# EAGLE design EEZ PSU AUX PS r5B9 (EAGLE 6.1)
Assembly variants: Farnell, TME

## Sheet 1 of 2: AC soft-start, +5V power
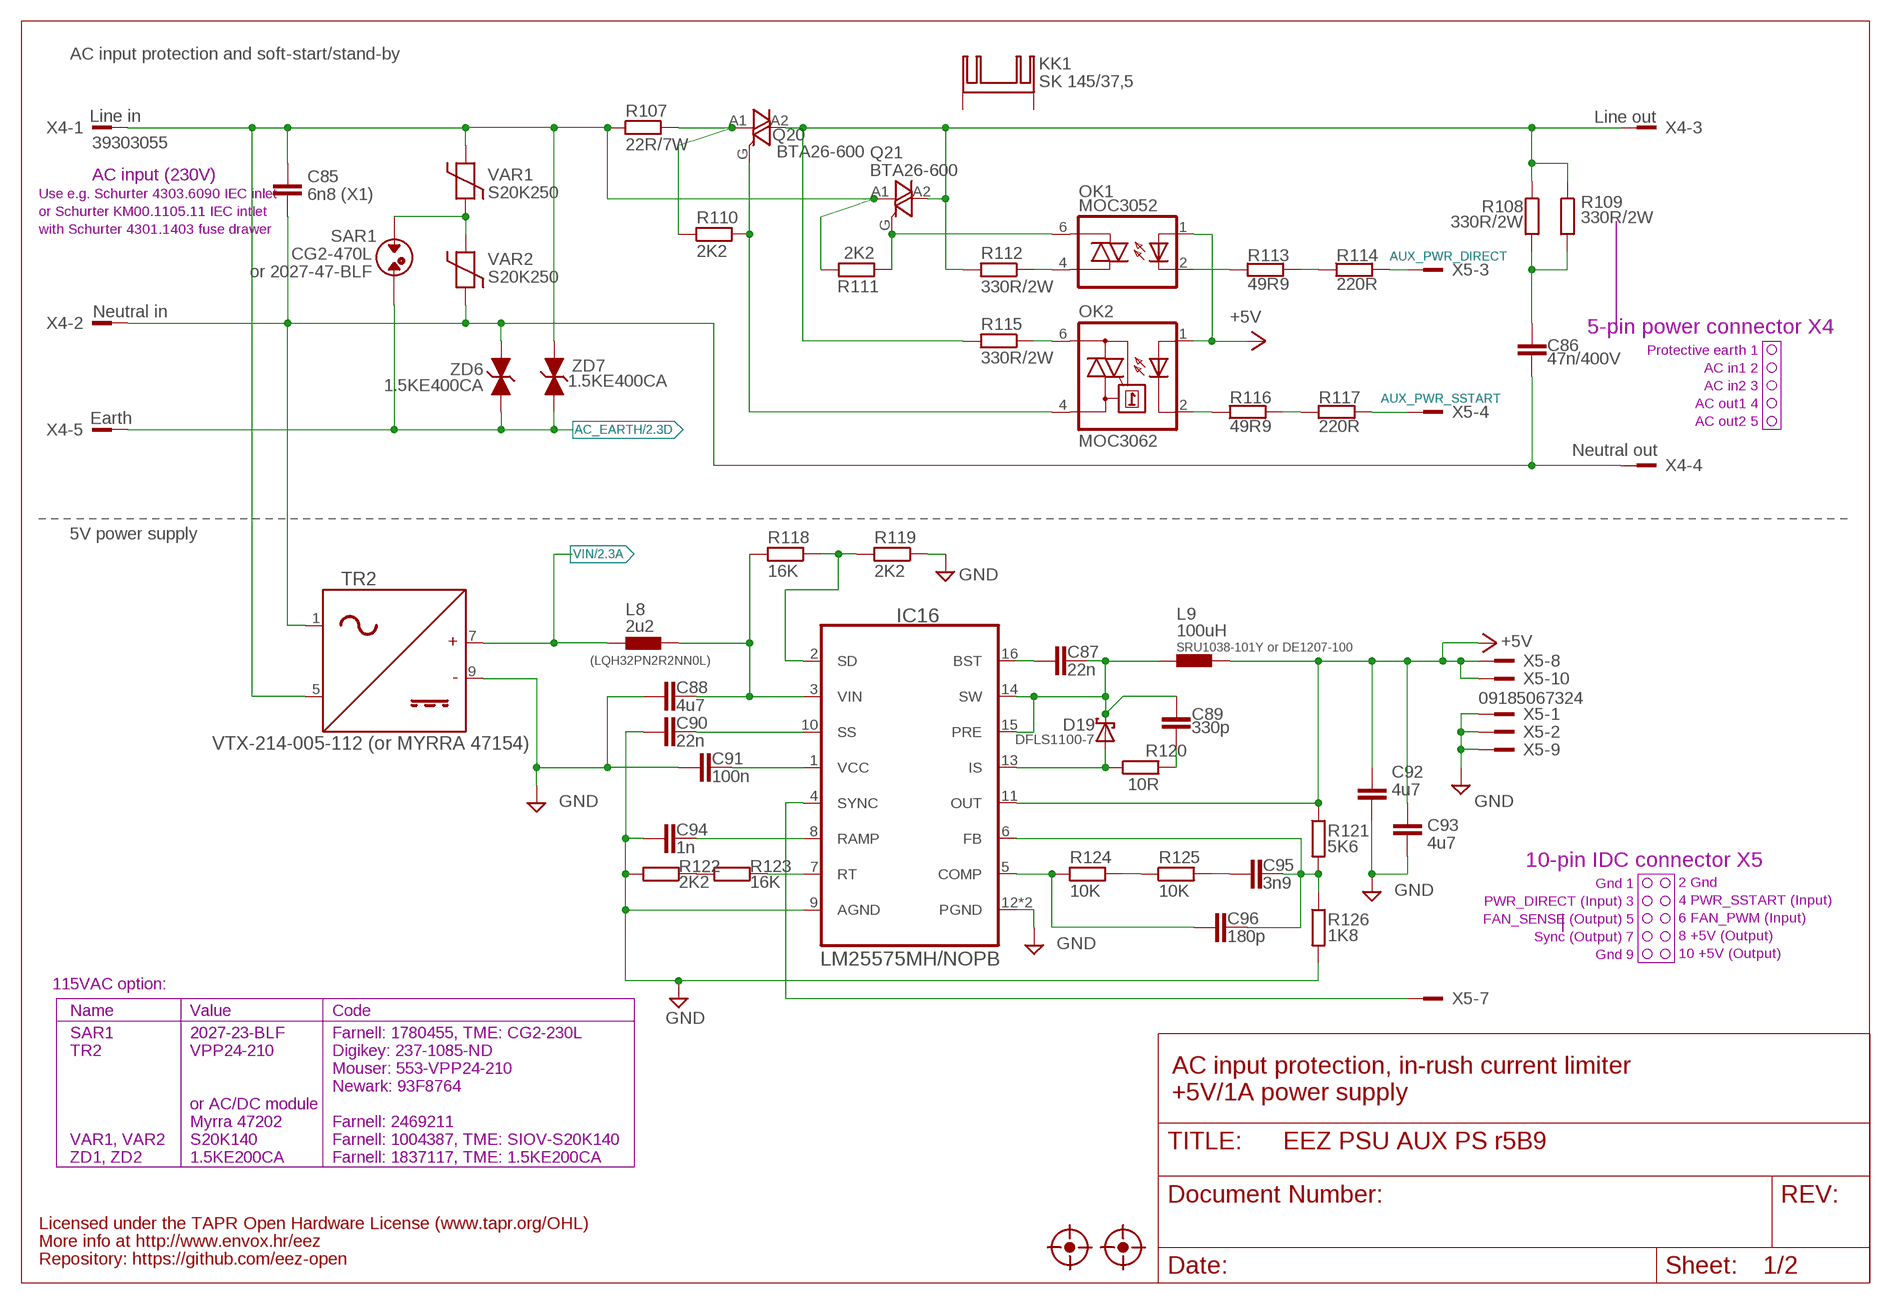
[diagram p0: schematic, sheet 1]

### Parts
C85  6n8 (X1)  C-EU102-064X133  [C102-064X133]
C86  47n/400V  C-EU075-052X106  [C075-052X106]
C87  22n  C-EUC0805  [C0805]
C88  4u7  C-EUC1210  [C1210]
C89  330p  C-EUC0805  [C0805]
C90  22n  C-EUC0805  [C0805]
C91  100n  C-EUC0603  [C0603]
C92  4u7  C-EUC1210  [C1210]
C93  4u7  C-EUC1210  [C1210]
C94  1n  C-EUC0805  [C0805]
C95  3n9  C-EUC0805  [C0805]
C96  180p  C-EUC0805  [C0805]
D19  DFLS1100-7  SCHOTTKYSOD123  [SOD123]
FM3  FIDUCIAL_2  [FIDUCIAL_DUAL]
FM4  FIDUCIAL_2  [FIDUCIAL_DUAL]
IC16  LM25575MH/NOPB  LM(2)5575  [SOP65P640X110-17N]
KK1  SK 145/37,5  SK145  [SK145]
L8  2u2  L1210  [L1210]
L9  100uH  COILCRAFT_MSS1278  [MSS1278]
OK1  MOC3052  MOC305X  [DIL6-SMD]
OK2  MOC3062  MOC3033S  [DIL6-SMD]
Q20  BTA26-600  BTA26-V  [TOP3S-1]
Q21  BTA26-600  BTA26-V  [TOP3S-1]
R107  22R/7W  R_EU7W  [R_0913]
R108  330R/2W  R-EU_R2512  [R2512]
R109  330R/2W  R-EU_R2512  [R2512]
R110  2K2  R-EU_R0805  [R0805]
R111  2K2  R-EU_R0805  [R0805]
R112  330R/2W  R-EU_R2512  [R2512]
R113  49R9  R-EU_R0805  [R0805]
R114  220R  R-EU_R0805  [R0805]
R115  330R/2W  R-EU_R2512  [R2512]
R116  49R9  R-EU_R0805  [R0805]
R117  220R  R-EU_R0805  [R0805]
R118  16K  R-EU_R0805  [R0805]
R119  2K2  R-EU_R0805  [R0805]
R120  10R  R-EU_R1206  [R1206]
R121  5K6  R-EU_R0805  [R0805]
R122  2K2  R-EU_R0805  [R0805]
R123  16K  R-EU_R0805  [R0805]
R124  10K  R-EU_R0805  [R0805]
R125  10K  R-EU_R0805  [R0805]
R126  1K8  R-EU_R0805  [R0805]
SAR1  CG2-470L  SAR  [SAR]
TR2  VTX-214-005-112 (or MYRRA 47154)  AC_DC_ADAPTER_5W  [PCB_ACDC_MYRRA_5W]
VAR1  S20K250  VARISTOR  [VARISTOR]
VAR2  S20K250  VARISTOR  [VARISTOR]
X4  39303055  MINIFIT_6659-5  [MINIFIT_6659-5]
X5  09185067324  IDC-10PINBLACK  [IDC-10PIN]
ZD6  1.5KE400CA  1.5KE-BIDIR  [DO201-BIDIR]
ZD7  1.5KE400CA  1.5KE-BIDIR  [DO201-BIDIR]

### Nets
+5V: C92.1 C93.1 IC16.11(OUT) L9.2 OK1.1(A) OK2.1(A) R121.1 X5.8 X5.10 ; also sheet 2
AC_EARTH: SAR1.P$2 X4.5 ZD6.C ZD7.C ; also sheet 2
AC_IN1_MAIN: C85.1 Q21.A1 R107.1 R111.2 TR2.5(IN2) VAR1.P$2 X4.1 ZD7.A
AC_IN2_MAIN: C85.2 C86.1 TR2.1(IN1) VAR2.P$1 X4.2 X4.4 ZD6.A
AUX_PWR_DIRECT: R114.2 X5.3
AUX_PWR_SSTART: R117.2 X5.4
DC_PREG2: C88.1 IC16.3(VIN) L8.2 R118.2
GND [gnd]: C88.2 C90.2 C91.1 C92.2 C93.2 C94.1 IC16.9(AGND) IC16.12(PGND) IC16.TP(PGND) R119.1 R122.2 R126.2 TR2.9(-) X5.1 X5.2 X5.9 ; also sheet 2
IS1: D19.A IC16.13(IS) R120.1
N$52: C95.2 R125.2
N$57: C95.1 C96.1 IC16.6(FB) R121.2 R126.1
N$58: C87.2 IC16.16(BST)
N$59: C96.2 IC16.5(COMP) R124.1
N$60: IC16.7(RT) R123.1
N$61: C91.2 IC16.1(VCC)
N$63: C94.2 IC16.8(RAMP)
N$66: C90.1 IC16.10(SS)
N$68: IC16.4(SYNC) X5.7
N$69: IC16.2(SD) R118.1 R119.2
N$70: C89.2 R120.2
N$71: OK1.6(A2) Q21.G R111.1
N$72: OK2.4(A1) Q20.G R110.2
N$73: OK2.6(A2) R115.1
N$74: R113.2 R114.1
N$75: R116.2 R117.1
N$76: OK1.4(A1) R112.1
N$81: Q20.A2 Q21.A2 R108.1 R109.1 R112.2 R115.2 X4.3
N$83: C86.2 R108.2 R109.2
N$114: SAR1.P$1 VAR1.P$1 VAR2.P$2
N$152: Q20.A1 R107.2 R110.1
N$169 [gnd]: R122.1 R123.2
N$171: R124.2 R125.1
N$174: OK2.2(C) R116.1
N$175: OK1.2(C) R113.1
SW2: C87.1 C89.1 D19.C IC16.14(SW) IC16.15(PRE) L9.1
VIN: L8.1 TR2.7(+) ; also sheet 2
Unconnected: KK1.1(K) KK1.2(K)

### Notes on the sheet
- AC input protection and soft-start/stand-by
- Line in
- Line out
- AC input (230V)
- Use e.g. Schurter 4303.6090 IEC inlet
- or Schurter KM00.1105.11 IEC intlet
- with Schurter 4301.1403 fuse drawer
- or 2027-47-BLF
- Neutral in
- 5-pin power connector X4
- Protective earth 1
- AC in1 2
- AC in2 3
- AC out1 4
- Earth
- AC out2 5
- Neutral out
- 5V power supply
- SRU1038-101Y or DE1207-100
- (LQH32PN2R2NN0L)
- 10-pin IDC connector X5
- Gnd 1
- 2 Gnd
- PWR_DIRECT (Input) 3
- 4 PWR_SSTART (Input)
- FAN_SENSE (Output) 5
- 6 FAN_PWM (Input)
- Sync (Output) 7
- 8 +5V (Output)
- Gnd 9
- 10 +5V (Output)
- 115VAC option:
- Name | Value | Code
- SAR1 | 2027-23-BLF | Farnell: 1780455, TME: CG2-230L
- TR2 | VPP24-210 | Digikey: 237-1085-ND
- Mouser: 553-VPP24-210 | AC input protection, in-rush current limiter
- Newark: 93F8764
- +5V/1A power supply
- or AC/DC module
- Myrra 47202 | Farnell: 2469211
- VAR1, VAR2 | S20K140 | Farnell: 1004387, TME: SIOV-S20K140
- ZD1, ZD2 | 1.5KE200CA | Farnell: 1837117, TME: 1.5KE200CA
- Licensed under the TAPR Open Hardware License (www.tapr.org/OHL)
- More info at http://www.envox.hr/eez
- Repository: https://github.com/eez-open

## Sheet 2 of 2: Ethernet, USB, Fan
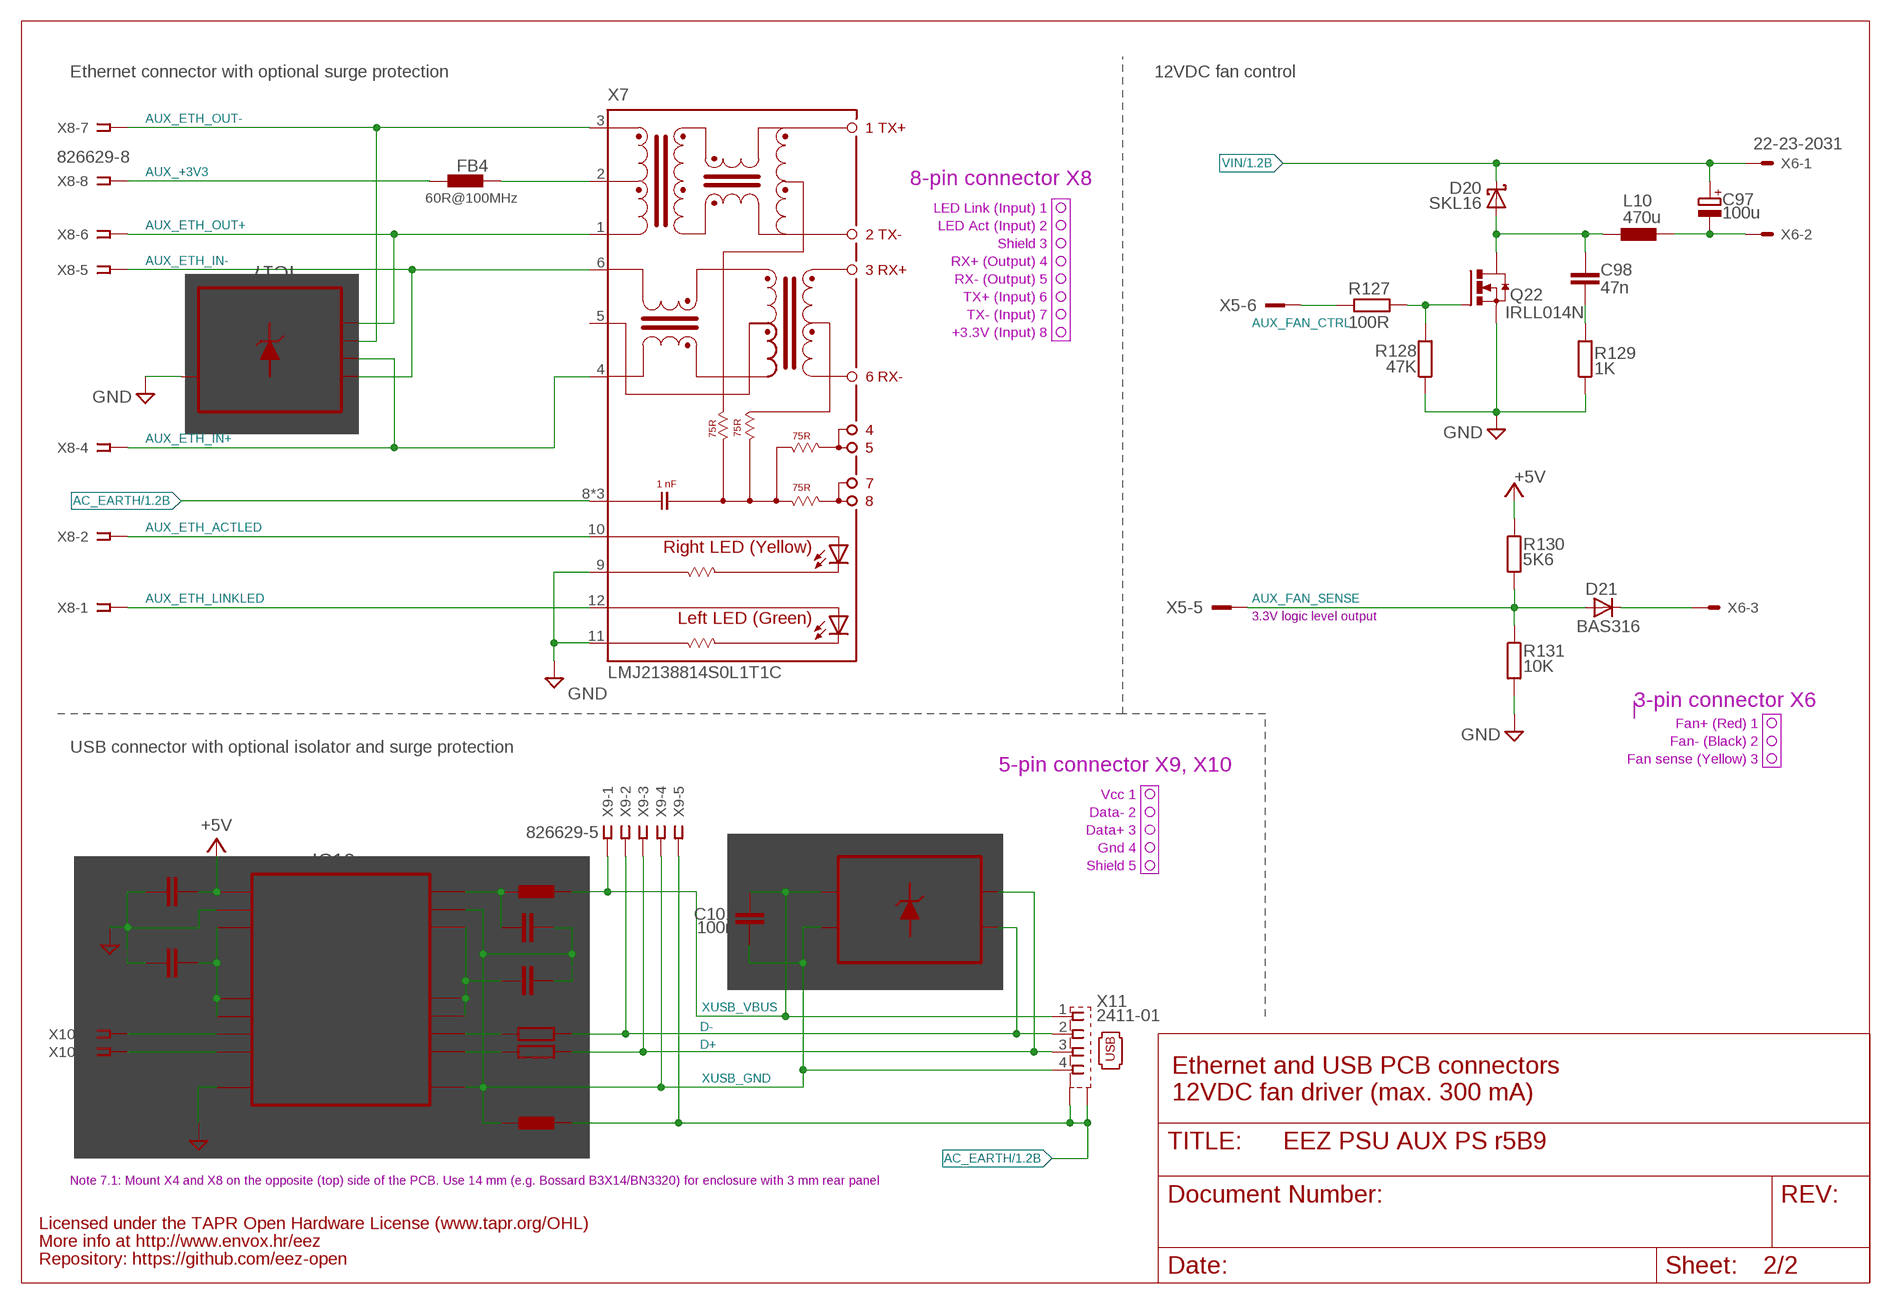
[diagram p1: schematic, sheet 2]

### Parts
C97  100u  ECAPPANASONIC_H  [CAPAE660X610N]
C98  47n  C-EUC0805  [C0805]
C99  100n  C-EUC0603  [C0603]
C100  100n  C-EUC0603  [C0603]
C101  100n  C-EUC0603  [C0603]
C102  100n  C-EUC0603  [C0603]
C103  100n  C-EUC0603  [C0603]
D20  SKL16  SCHOTTKYSOD123  [SOD123]
D21  BAS316  DIODE-SOD323-W  [SOD323-W]
FB4  60R@100MHz  FERRITE_BEAD0603  [BEAD0603]
FB5  60R@100MHz  FERRITE_BEAD0603  [BEAD0603]
FB6  60R@100MHz  FERRITE_BEAD0603  [BEAD0603]
IC17  TPD4E002DRLR  [SOT50P280X60-5N]
IC18  TPD2E001DZDR  [SOP192P292X122-4N]
IC19  ADUM3160BRWZ  ADUM3160BRWZWIDE  [SOIC-16W]
L10  470u  DE0704  [DE0704]
Q22  IRLL014N  N-HEXFET-2D_SOT232-IRLL014N  [SOT223]
R127  100R  R-EU_R0805  [R0805]
R128  47K  R-EU_R0805  [R0805]
R129  1K  R-EU_R0805  [R0805]
R130  5K6  R-EU_R0805  [R0805]
R131  10K  R-EU_R0805  [R0805]
R132  22R  R-EU_R0805  [R0805]
R133  22R  R-EU_R0805  [R0805]
X6  22-23-2031  [22-23-2031]
X7  LMJ2138814S0L1T1C  RJ45-VERTLMJ2138814S0L1T1C  [RJ45-VERT]
X8  826629-8  SSW-108-02-S-S  [SSW-108-02-S-S]
X9  826629-5  SSW-105-02-S-S  [SSW-105-02-S-S]
X10  826629-5  SSW-105-02-S-S  [SSW-105-02-S-S]
X11  2411-01  KUSBVX-BS1N  [KUSBVX-BS1N]

### Nets
+5V: C99.1 IC19.16(VBUS2) R130.1 ; also sheet 1
AC_EARTH: FB6.P$1 X7.8(SH) X7.SH1(SH) X7.SH2(SH) X9.5 X11.M1(S1) X11.M2(S2) ; also sheet 1
AUX_+3V3: FB4.P$2 X8.8
AUX_ETH_ACTLED: X7.10(YELLOW_A) X8.2
AUX_ETH_IN+: IC17.4(IO3) X7.4(RD-) X8.4
AUX_ETH_IN-: IC17.5(IO4) X7.6(RD+) X8.5
AUX_ETH_LINKLED: X7.12(GREEN-A) X8.1
AUX_ETH_OUT+: IC17.1(IO1) X7.1(TD-) X8.6
AUX_ETH_OUT-: IC17.3(IO2) X7.3(TD+) X8.7
AUX_FAN_CTRL: R127.2 X5.6
AUX_FAN_SENSE: D21.A R130.2 R131.1 X5.5
D+: IC18.2(IO1) R133.1 X9.3 X11.3
D-: IC18.3(IO2) R132.1 X9.2 X11.2
FAN_OUT: C98.2 D20.A L10.2 Q22.2(D) Q22.4(D)
GND [gnd]: C99.2 C102.2 IC17.2(GND) IC19.9(GND2) IC19.15(GND2_2) Q22.3(S) R128.1 R129.1 R131.2 X7.9(YELLOW-C) X7.11(GREEN-C) ; supply symbol labelled PGND ; also sheet 1
MCU_D+: IC19.10(DD+) X10.3
MCU_D-: IC19.11(DD-) X10.2
N$84: C98.1 R129.2
N$85: Q22.1(G) R127.1 R128.2
N$86: C97.2(-) L10.1 X6.2
N$87: C103.1 IC19.3(VDD1) IC19.4(PDEN) IC19.5(SPU)
N$88: IC19.6(UD-) R132.2
N$89: IC19.7(UD+) R133.2
N$90: C100.1 FB5.P$2 IC19.1(VBUS1)
N$91: C102.1 IC19.12(PIN) IC19.13(SPD) IC19.14(VDD2)
N$125: FB4.P$1 X7.2(CT)
N$163: D21.C X6.3
VIN: C97.1(+) D20.C X6.1 ; also sheet 1
XUSB_GND: C100.2 C101.1 C103.2 FB6.P$2 IC18.1(GND) IC19.2(GND1_2) IC19.8(GND1) X9.4 X11.4
XUSB_VBUS: C101.2 FB5.P$1 IC18.4(VCC) X9.1 X11.1
Unconnected: X7.5(CR) X8.3 X10.1 X10.4 X10.5

### Notes on the sheet
- Ethernet connector with optional surge protection | 12VDC fan control
- 8-pin connector X8
- LED Link (Input) 1
- LED Act (Input) 2
- Shield 3
- RX+ (Output) 4
- RX- (Output) 5
- TX+ (Input) 6
- TX- (Input) 7
- +3.3V (Input) 8
- 3.3V logic level output
- 3-pin connector X6
- Fan+ (Red) 1
- Fan- (Black) 2
- USB connector with optional isolator and surge protection
- Fan sense (Yellow) 3
- 5-pin connector X9, X10
- Vcc 1
- Data- 2
- Data+ 3
- Gnd 4
- Shield 5
- Ethernet and USB PCB connectors
- 12VDC fan driver (max. 300 mA)
- Note 7.1: Mount X4 and X8 on the opposite (top) side of the PCB. Use 14 mm (e.g. Bossard B3X14/BN3320) for enclosure with 3 mm rear panel
- Licensed under the TAPR Open Hardware License (www.tapr.org/OHL)
- More info at http://www.envox.hr/eez
- Repository: https://github.com/eez-open

## Library data of the parts
C85-C96 C98-C103 = rcl:C-EU: CAPACITOR, European symbol
C97 = EEZ_Lib1:ECAP
D19 D20 = EEZ_Lib1:SCHOTTKY
D21 = diode:DIODE-: DIODE
FB4-FB6 = MyLib6:FERRITE_BEAD: FAIR-RITE - 2506033007Y3 - FERRITE BEAD, 0.04OHM, 3A, 0603 Farnell: 2112873
FM3 FM4 = EEZ_Lib1:FIDUCIAL: Fiducial mark for pick and place automation
IC16 = EEZ_Lib1:LM(2)5575: Simple Switcher® 42V, 1.5A Step-Down Switching Regulator
IC17 = EEZ_Lib1:TPD4E002: Low-Capacitance 4-Channel +/-15-kV ESD Protection Array for High-Speed Data Interfaces
IC18 = EEZ_Lib1:TPD2E001: Low-Capacitance 2-Channel +/-15 kV ESD-Protection Array for High-Speed Data Interfaces
IC19 = MyLib6:ADUM3160BRWZ: Full/Low Speed 2.5 kV USB Digital Isolator
KK1 = EEZ_Lib1:SK145: FISCHER ELEKTRONIK SK 145/37,5 STS-220 Heat Sink, TO-220, TO-218, TO-220, TO-247, TO-248, 12 °C/W, 29 mm, 12 mm
L8 = EEZ_Lib1:L1210
L9 = EEZ_Lib1:COILCRAFT_MSS1278: Coilcraft SMT Power Inductors – MSS1278
L10 = EEZ_Lib1:DE0704: Ferrocore SMD power coil 7.3 x 7.3 mm
OK1 = EEZ_Lib1:MOC305X: 6-pin DIP Random-phase Optoisolators Triac Drivers (600V Peak)
OK2 = optocoupler:MOC30*: 6-Pin DIP Zero-Cross Optoisolators Triac Driver Output (250/400 Volt Peak) Source: http://www.fairchildsemi.com/ds/MO/MOC3043-M.pdf; MF: FAIRCHILD SEMICONDUCTOR; MPN: MOC3033S-M; OC_FARNELL: unknown; OC_NEWARK: 05C2878
Q20 Q21 = triac:BTA26: 25A TRIAC Source: http://www.st.com/stonline/products/literature/ds/7470.pdf
Q22 = transistor-power:N-HEXFET-2D_?-*: HEXFET® Power MOSFET 2 Drain connects http://www.irf.com/product-info/datasheets/data/irll014n.pdf
R107 = EEZ_Lib1:R_EU: RESISTOR - European symbol
R108-R133 = rcl:R-EU_: RESISTOR, European symbol
SAR1 = EEZ_Lib1:SAR: EPCOS surge arrester EF470X Farnell: 1886596
TR2 = EEZ_Lib1:AC_DC_ADAPTER: MYRRA 47202 AC/DC PCB Mount Power Supply, Switch Mode, Fixed, 1 Output
VAR1 VAR2 = EEZ_Lib1:VARISTOR: EPCOS - B72220S0251K101 - VARISTOR, 140J, 250VAC Farnell: 1004357
X4 = EEZ_Lib1:MINIFIT_6659-5: MOLEX 39303035 Wire-To-Board Connector, Single In Line, Mini-Fit Jr 5569 Series, 5 Contacts, Plug, 4.2 mm
X5 = EEZ_Lib1:IDC-10PIN: 10-pin IDC socket male, straight; TME: T821-1-10-S1
X6 = con-molex:22-23-2031: .100" (2.54mm) Center Header - 3 Pin; MF: MOLEX; MPN: 22-23-2031; OC_FARNELL: 1462950; OC_NEWARK: 30C0862
X7 = EEZ_Lib1:RJ45-VERT: AMPHENOL LMJ2138812S0LOT6C Socket; RJ45; PIN:8; vertical, shielded, with LED and trafo
X8 = con-samtec:SSW-108-02-S-S: THROUGH-HOLE .025" SQ POST SOCKET Source: Samtec SSW.pdf; MPN: SSW-108-02-S-S; OC_FARNELL: unknown; OC_NEWARK: 11P9448
X9 X10 = con-samtec:SSW-105-02-S-S: THROUGH-HOLE .025" SQ POST SOCKET Source: Samtec SSW.pdf; MPN: SSW-105-02-S-S; OC_FARNELL: unknown; OC_NEWARK: 11P9399
X11 = con-kycon:KUSBVX-BS1N: USB B-type Receptacle Vertical, 4 Position, Through Hole Source: Sibalco Kycon KUSBVX-BS1N-xxx.pdf
ZD6 ZD7 = EEZ_Lib1:1.5KE-BIDIR

## Net classes
0 default: width 0.254 mm, drill 0.584 mm, clearance 0.254 mm
1 dgnd: width 0.254 mm, drill 0.584 mm, clearance 0.254 mm
2 gnd: width 0.254 mm, drill 0.584 mm, clearance 0.254 mm

## Board
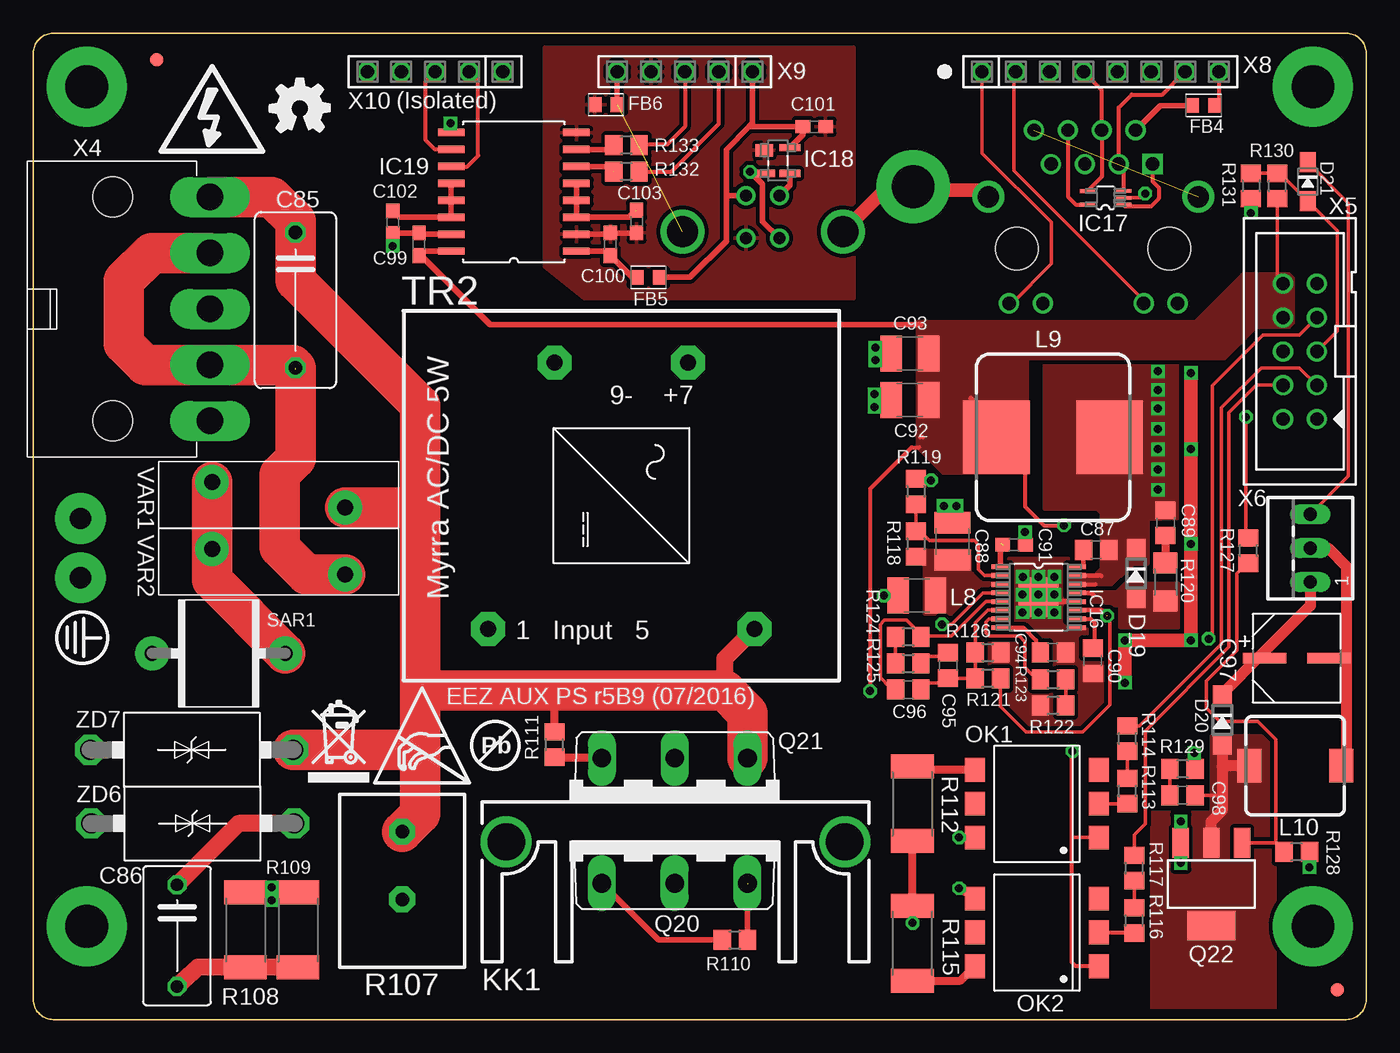
[diagram p2: board, top side]
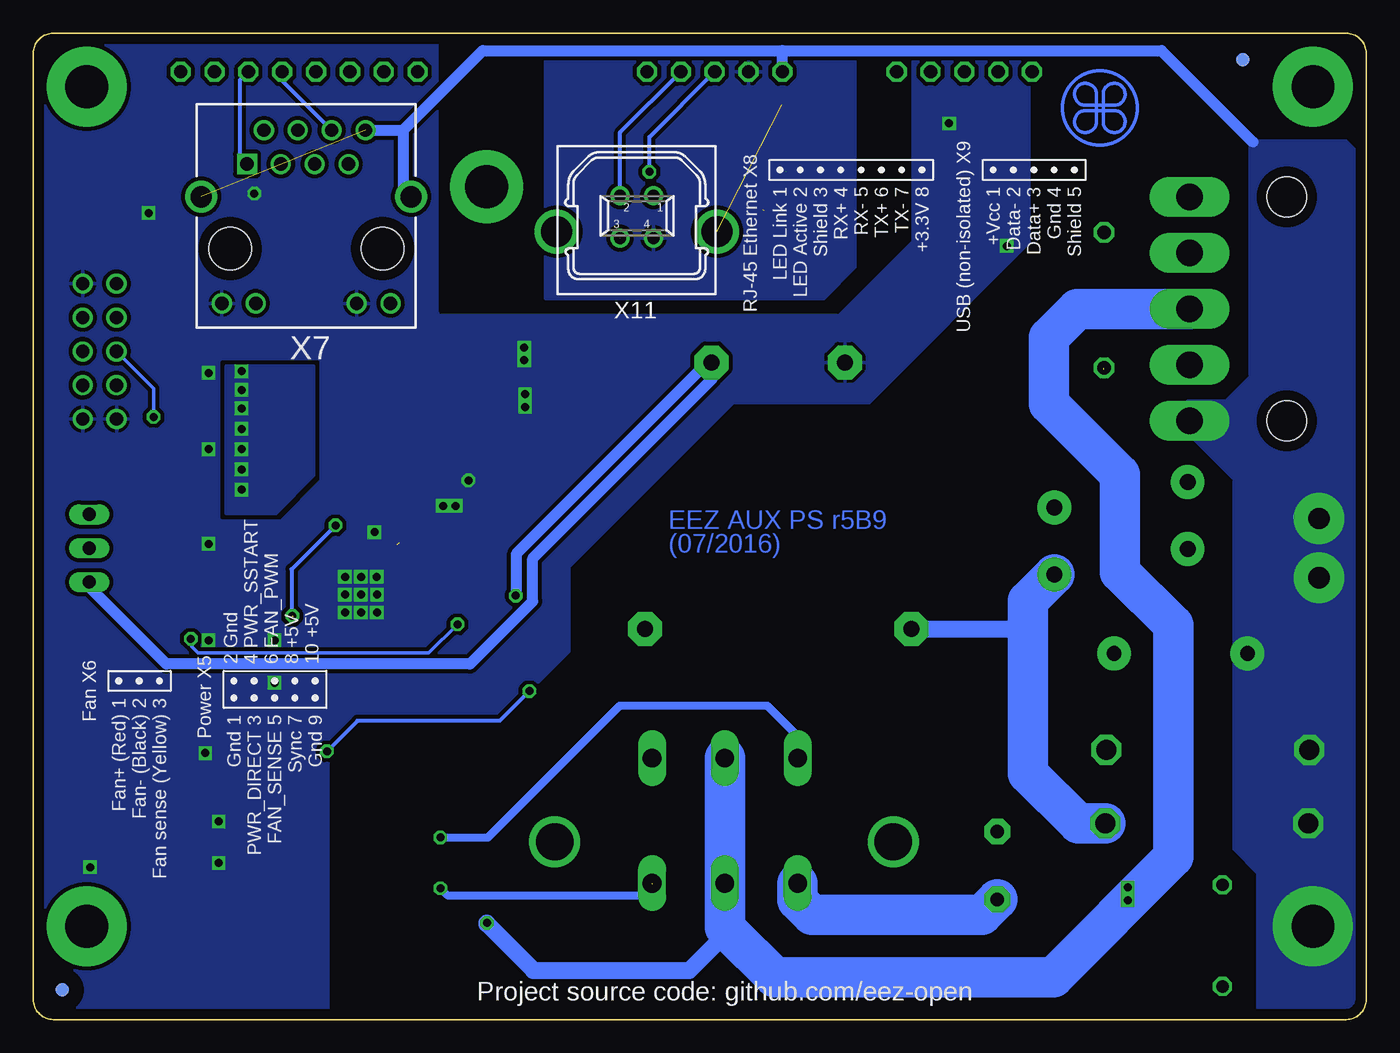
[diagram p3: board, bottom side, seen from below]

Size 100 x 74 mm. Coordinates in mm from the lower left corner, seen from the top.
Outline: 1.5,74 98.5,74 arc-90 100,72.5 100,1.5 arc-90 98.5,0 1.5,0 arc-90 0,1.5 0,72.5 arc-90 1.5,74
Copper layers (1+5*16): Top 0.035mm / dielectric 0.75mm / Route5 0.035mm / dielectric 0.75mm / Bottom 0.035mm
Design rules: minimum track width 10mil, minimum drill 0.5mm, track to track 8mil, track to pad 8mil, pad to pad 8mil, via to via 8mil, smd to smd 8mil, copper to edge 30mil, drill to drill 8mil, minimum pad ring 10mil, minimum via ring 8mil, stop-mask expansion 4mil, vias tented up to drill 25mil, thermal gap 10mil

### Footprints (pad centres in the part's own frame; a part is rotated, then mirrored left to right if it is on the bottom)
C102-064X133 = drill 1.016 octagon: 1 -5.08,0; 2 5.08,0
C075-052X106 = drill 0.914 octagon: 1 -3.81,0; 2 3.81,0
C0805 = smd 1.3 x 1.5: 1 -0.95,0; 2 0.95,0
C1210 = smd 1.6 x 2.7: 1 -1.4,0; 2 1.4,0
C0603 = smd 1.1 x 1: 1 -0.85,0; 2 0.85,0
CAPAE660X610N = smd 3.251 x 0.762: 1 -2.413,0; 2 2.413,0
SOD123 = smd 1.4 x 1.4: A 1.9,0; C -1.9,0
SOD323-W = smd 1.5 x 1.2: A 1.45,0; C -1.45,0
BEAD0603 = smd 1 x 1.1: P$1 -0.85,0; P$2 0.85,0
FIDUCIAL_DUAL = smd 1.016 x 1.016 bottom: B 0,0 | smd 1.016 x 1.016: T 0,0
SOP65P640X110-17N = smd 1.422 x 0.356: 1 -2.845,2.286; 2 -2.845,1.626; 3 -2.845,0.965; 4 -2.845,0.33; 5 -2.845,-0.33; 6 -2.845,-0.965; 7 -2.845,-1.626; 8 -2.845,-2.286; 9 2.845,-2.286; 10 2.845,-1.626; 11 2.845,-0.965; 12 2.845,-0.33; 13 2.845,0.33; 14 2.845,0.965; 15 2.845,1.626; 16 2.845,2.286 | smd 2.997 x 2.997: TP 0,0
SOT50P280X60-5N = smd 1.118 x 0.254: 1 -1.372,0.508; 2 -1.372,0; 3 -1.372,-0.508 | smd 1.118 x 0.305: 4 1.372,-0.508; 5 1.372,0.508
SOP192P292X122-4N = smd 0.94 x 1.321: 1 -0.762,-1.016 | smd 0.559 x 1.575: 2 0.965,-1.016; 3 0.965,0.889; 4 -0.965,0.889
SOIC-16W = smd 1.981 x 0.559: 1 -4.699,4.445; 2 -4.699,3.175; 3 -4.699,1.905; 4 -4.699,0.635; 5 -4.699,-0.635; 6 -4.699,-1.905; 7 -4.699,-3.175; 8 -4.699,-4.445; 9 4.699,-4.445; 10 4.699,-3.175; 11 4.699,-1.905; 12 4.699,-0.635; 13 4.699,0.635; 14 4.699,1.905; 15 4.699,3.175; 16 4.699,4.445
SK145 = drill 2.8: 1 -12.7,0; 2 12.7,0
L1210 = smd 1.6 x 2.7: 1 -1.4,0; 2 1.4,0
MSS1278 = smd 5.5 x 5: 1 0,4.25; 2 0,-4.25
DE0704 = smd 2.5 x 1.8: 1 0,3.45; 2 0,-3.45
DIL6-SMD = smd 1.78 x 1.52: 1 -2.54,-4.645; 2 0,-4.645; 3 2.54,-4.645; 4 2.54,4.645; 5 0,4.645; 6 -2.54,4.645
TOP3S-1 = drill 1.397 long: A1 -5.461,-3.175; A2 0,-3.175; G 5.461,-3.175
SOT223 = smd 1.219 x 2.235: 1 -2.311,-3.099; 2 0,-3.099; 3 2.311,-3.099 | smd 3.6 x 2.2: 4 0,3.099
R_0913 = drill 1.016 pad 1.93 octagon: 1 -3.556,0; 2 1.524,0
R2512 = smd 1.8 x 3.2: 1 -2.8,0; 2 2.8,0
R0805 = smd 1.3 x 1.5: 1 -0.95,0; 2 0.95,0
R1206 = smd 1.6 x 1.803: 1 -1.422,0; 2 1.422,0
SAR = drill 1.1 pad 2.54: P$1 0,0; P$2 10,0
PCB_ACDC_MYRRA_5W = drill 1.2 pad 2.54 octagon: 1 10,-10; 5 10,10; 7 -10,5; 9 -10,-5
VARISTOR = drill 1.2 pad 2.54: P$1 -5,0.95; P$2 5,-0.95
MINIFIT_6659-5 = drill 2 pad 2.54 long: 1 0,0; 2 0,-4.2; 3 0,-8.4; 4 0,-12.6; 5 0,-16.8 | hole 3: -7.3,0; -7.3,-16.8
IDC-10PIN = drill 1 pad 1.422: 1 -5.08,-1.27; 2 -5.08,1.27; 3 -2.54,-1.27; 4 -2.54,1.27; 5 0,-1.27; 6 0,1.27; 7 2.54,-1.27; 8 2.54,1.27; 9 5.08,-1.27; 10 5.08,1.27
22-23-2031 = drill 1 long: 1 -2.54,0; 2 0,0; 3 2.54,0
RJ45-VERT = drill 1 square: 1 4.445,-5.08 | drill 1: 2 3.175,-7.62; 3 1.905,-5.08; 4 0.635,-7.62; 5 -0.635,-5.08; 6 -1.905,-7.62; 7 -3.175,-5.08; 8 -4.445,-7.62; 9 6.325,5.38; 10 3.785,5.38; 11 -3.785,5.38; 12 -6.325,5.38 | drill 1.6: SH1 7.875,-2.62; SH2 -7.875,-2.62 | hole 3.2: -5.715,1.27; 5.715,1.27
SSW-108-02-S-S = drill 1 pad 1.5 octagon: 1 -8.89,0; 2 -6.35,0; 3 -3.81,0; 4 -1.27,0; 5 1.27,0; 6 3.81,0; 7 6.35,0; 8 8.89,0
SSW-105-02-S-S = drill 1 pad 1.5 octagon: 1 -5.08,0; 2 -2.54,0; 3 0,0; 4 2.54,0; 5 5.08,0
KUSBVX-BS1N = drill 0.9 pad 1.422: 1 1.25,2.7; 2 -1.25,2.7; 3 -1.25,-0.5; 4 1.25,-0.5 | drill 2.3 pad 2.7: M1 -6.02,0; M2 6.02,0
DO201-BIDIR = drill 1.499 octagon: A 7.62,0; C -7.62,0

### Placement (x,y rotation side)
C85  19.67,53.98 270 top
C86  10.78,6.29 270 top
C87  79.74,35.24 180 top
C88  68.95,35.88 90 top
C89  84.95,37.27 270 top
C90  79.49,26.92 270 top
C91  73.58,35.62 180 top
C92  65.77,46.48 180 top
C93  65.77,49.97 180 top
C94  76.5,27.56 180 top
C95  68.63,26.57 90 top
C96  65.64,24.77 180 top
C97  94.79,27.11 0 top
C98  86.22,16.83 0 top
C99  28.94,58.17 90 top
C100  43.29,58.17 90 top
C101  58.6,66.99 180 top
C102  26.97,59.82 270 top
C103  45.26,59.88 270 top
D19  82.73,33.46 270 top
D20  89.2,22.48 270 top
D21  95.62,62.87 270 top
EEZ_SIGNATURE1  SIGNATURESMALL  [SIGNATURE_5MM]  19.98,68.4 180 top
FB4  87.81,68.58 0 top
FB5  46.15,55.69 180 top
FB6  42.97,68.64 180 top
FM3  9.26,72.01 0 top
FM4  97.84,2.22 0 top
IC16  75.42,31.69 0 top
IC17  80.44,61.66 180 top
IC18  55.87,64.45 270 top
IC19  36.05,62.1 180 top
KK1  48.18,13.34 180 top
L8  66.28,31.81 0 top
L9  76.5,43.69 270 top
L10  94.66,19.05 270 top
OK1  75.3,16.19 90 top
OK2  75.3,6.54 90 top
Q20  48.12,13.4 0 top
Q21  48.12,16.45 180 top
Q22  88.38,10.16 180 top
R107  27.67,10.54 270 top
R108  15.92,6.73 270 top
R109  19.86,6.73 270 top
R110  52.63,5.97 0 top
R111  39.1,20.64 90 top
R112  65.96,16.19 270 top
R113  82.09,17.14 90 top
R114  82.09,21.08 90 top
R115  65.96,5.71 90 top
R116  82.6,7.43 90 top
R117  82.6,11.37 90 top
R118  66.22,35.69 270 top
R119  66.22,39.62 270 top
R120  84.95,32.83 90 top
R121  71.61,25.59 180 top
R122  76.5,23.56 180 top
R123  76.5,25.53 0 top
R124  65.64,28.7 180 top
R125  65.64,26.73 0 top
R126  71.61,27.56 0 top
R127  91.17,35.18 90 top
R128  94.79,12.57 180 top
R129  86.22,18.8 180 top
R130  93.33,62.55 90 top
R131  91.36,62.55 270 top
R132  44.5,63.63 180 top
R133  44.5,65.6 180 top
SAR1  18.91,27.47 180 top
TR2  44.12,39.31 270 top
U$1  [RECYCLE_BIN1/8]  20.63,17.78 0 top
U$5  [PB_SMALL]  34.66,20.57 0 top
U$6  [ESD_SYMBOL]  25.61,17.76 0 top
VAR1  18.4,39.37 0 top
VAR2  18.4,34.35 180 top
X4  13.26,61.72 0 top
X5  95.03,50.13 90 top
X6  95.81,35.37 90 top
X7  79.53,59.12 180 bottom
X8  80.06,71.12 0 top
X9  48.88,71.12 180 top
X10  30.15,71.12 180 top
X11  54.73,59.12 0 bottom
ZD6  11.95,14.71 0 top
ZD7  11.89,20.24 0 top

### Tracks (layer width: path | path; a pad name or v marks a point on that pad's centre or on a via)
+5V  (via drill 0.6)  (1 unrouted)
  Top 0.254: 80.5,30.29 80.76,30.04 80.76,23.62 78.72,21.59 74.47,21.59 72.57,23.5 72.57,25.46 72.5,25.53 72.56,25.53 R121.1 | 93.67,55.12 X5.10 93.33,55.64 R130.1 | OK1.1 77.9,13.65
  Top 0.305: 70.72,46.1 70.79,46.16 70.79,45.66 72.18,44.26 | 72.18,44.26 72.25,44.2 | L9.2 72.25,44.32 72.18,44.26 | 72.25,44.13 74.41,41.97 74.41,38.48 75.8,37.08 v77.33,37.08 | 66.72,43.69 66.53,43.69 | 66.47,42.93 65.9,42.93 62.79,39.81 v62.79,24.64 | v77.96,20.13 77.9,20.07 77.9,13.65 77.9,4.32 78.22,4 OK2.1
  Top 0.356: IC16.11 80.14,30.72 v80.57,30.29
  Top 0.406: 70.34,46.61 70.79,46.16 | 66.6,52.13 34.27,52.13 29.09,57.32 C99.1 29.28,57.66 IC19.16
  Bottom 0.305: v80.57,30.29 80.63,30.35 80.63,33.78 v77.33,37.08 | v62.79,24.64 65.01,22.42 75.68,22.42 v77.96,20.13
  pour Top (isolate 0.305, rank 2, no thermals): 74.6,41.02 68.25,41.02 66.34,42.93 66.34,52.39 87.17,52.39 90.73,55.94 94.22,55.94 94.54,55.63 94.54,52.26 94.22,51.94 91.74,51.94 89.39,49.59 74.6,49.59
AC_EARTH  (via drill 1.6 pad 3.81, 3.2 pad 5.5, 3.2 pad 6)  (2 unrouted)
  Top 0.406: X9.5 43.8,68.67 FB6.P$1
  Top 0.813: v66,62.5 66,62.32 66.09,62.23
  Top 1.016: X7.SH2 70.97,62.23 66.09,62.23 63.85,62.23 X11.M1
  Bottom 0.254: 4.77,33.15 4.77,33.34
  Bottom 0.813: X7.8 72.25,66.74 | 72.25,66.74 66.28,72.71 43.8,72.71 | 43.8,72.71 15.35,72.71 8.49,65.85 | X9.5 43.8,72.71 | 72.25,66.74 72.25,62.53 X7.SH2
  Bottom 1.016: 4.96,37.69 4.84,37.69
  other vias: 3.54,37.59 3.54,33.15 4,7
  pour Bottom (isolate 0.406, no thermals): 8.11,0.19 -0.27,0.19 0.05,64.45 1.51,65.91 8.68,65.91 8.68,48.26 10.53,46.42 13.38,46.42 13.38,43.62 13,43.62 9.89,40.51 9.89,12.76 8.11,10.99
AC_IN1_MAIN
  Top 0.61: R111.2 39.1,24.45 39.04,24.51 39.04,24.61 38.97,24.68
  Top 1.27: 51.89,24.68 51.89,27.08 TR2.5
  Top 3.048: X4.1 17.89,61.72 19.67,59.94 C85.1 19.67,55.44 29.01,46.1 29.01,37.91 | 29.01,37.91 29.01,24.64 | 29.01,24.64 29.01,20.45 | 29.01,20.45 29.01,15.43 R107.1 | VAR1.P$2 29,38.42 29.01,37.91 | Q21.A1 53.58,22.99 51.89,24.68 38.97,24.68 29.04,24.68 29.01,24.64 | ZD7.A 28.8,20.24 29.01,20.45
AC_IN2_MAIN  (1 unrouted)
  Top 1.27: ZD6.A 15.39,14.71 C86.1
  Top 3.048: X4.2 8.87,57.52 6.78,55.44 6.78,50.74 8.39,49.12 X4.4 19.44,49.12 C85.2 | VAR2.P$1 20.49,33.4 18.46,35.43 18.46,40.89 19.67,42.1 19.67,48.77
  Bottom 0.61: 25.48,29.31 25.42,29.31 25.38,29.27
  Bottom 1.27: TR2.1 25.48,29.31
  Bottom 3.048: ZD6.A 21.61,14.71 25.38,18.48 25.38,29.27 25.38,31.42 VAR2.P$1
AUX_+3V3
  Top 0.305: X8.8 88.95,68.87 FB4.P$2
AUX_ETH_ACTLED
  Top 0.254: X8.2 73.58,70.99 73.58,63.69 83.31,53.96 X7.10
AUX_ETH_IN+
  Top 0.305: IC17.4 80.16,63.26 X7.4 80.16,69.75 X8.4
AUX_ETH_IN-
  Top 0.305: X7.6 77.62,61.75 78.22,61.15 IC17.5
  Bottom 0.305: X8.5 81.33,70.44 X7.6
AUX_ETH_LINKLED
  Top 0.254: X8.1 71.17,65.02 76.38,59.82 76.38,56.71 73.41,53.74 X7.12
AUX_ETH_OUT+
  Top 0.254: IC17.1 81.81,61.11 81.9,61.02
  Top 0.305: X7.1 83.97,62.89 84.44,62.42 84.44,61.59 83.87,61.02 81.9,61.02
  Bottom 0.305: 84.19,64.41 X7.1 84.5,64.73 84.5,70.48 X8.6
AUX_ETH_OUT-
  Top 0.254: IC17.3 81.81,62.27 81.84,62.29
  Top 0.305: 81.84,62.29 81.84,63.79 X7.3 81.43,68.43 82.41,69.41 84.69,69.41 X8.7
AUX_FAN_CTRL  (via drill 0.6)
  Top 0.254: v90.98,45.21 90.98,36.83 R127.2
  Bottom 0.254: v90.98,45.21 90.98,47.35 X5.6
AUX_FAN_SENSE
  Top 0.254: X5.5 97.84,51.67 97.84,59.19 D21.A 93.53,63.5 R130.2 R131.1 91.18,63.68
AUX_PWR_DIRECT
  Top 0.254: X5.3 96.28,47.59 94.98,48.9 92.12,48.9 89.14,45.91 89.14,28.19 82.98,22.03 R114.2
AUX_PWR_SSTART
  Top 0.254: X5.4 91.78,47.59 89.71,45.53 89.71,27.94 83.42,21.65 83.42,14.67 82.6,13.84 R117.2
D+  (via drill 0.6)  (1 unrouted)
  Top 0.305: X9.3 48.88,66.99 47.55,65.66 45.51,65.66 R133.1
  Top 0.406: IC18.2 53.91,63.49 v53.78,63.61 54.72,62.67 54.72,59.88 X11.3
  Bottom 0.305: v53.78,63.61 53.78,66.22 X9.3
D-
  Top 0.305: R132.1 47.86,63.63 51.42,67.18 X9.2
  Top 0.406: IC18.3 56.75,62.6 X11.2
  Bottom 0.305: X11.2 55.98,66.56 X9.2
DC_PREG2
  pour Top (isolate 0.305, rank 2, no thermals): 72.57,33.46 72.57,32.13 71.42,32.13 69.71,30.42 66.85,30.42 66.85,35.18 70.28,35.18 70.28,33.46
FAN_OUT
  Top 0.254: C98.2 89.2,16.83
  Top 0.813: D20.A 89.2,18.99 | 89.2,18.99 89.2,16.83 89.2,15.68 88.38,14.86 Q22.2 | L10.2 89.27,19.05 89.2,18.99
  pour Top (isolate 0.305, no thermals): 88.38,21.27 93.14,21.27 93.14,0.32 83.93,0.32 83.93,15.56 88.38,15.56
GND  (via drill 0.6)
  Top 0.254: v69.26,38.54 69.26,37.59 C88.2 | IC19.9 31.29,66.55 v31.29,67.25 | v67.36,40.45 66.41,40.45 R119.1 | v91.36,60.52 R131.2 | v87.11,20 87.11,18.86 R129.1 | v86.09,11.75 86.09,13.23 Q22.3 | R128.1 v95.74,11.43 | IC17.2 83.23,61.66 v83.42,61.98
  Top 0.305: v63.17,49.47 63.86,49.47 C93.2 | C91.1 v74.41,36.58 | v63.1,45.97 63.93,45.97 C92.2
  Top 0.406: IC19.15 28.98,58.93 C99.2 26.99,59.02 C102.2 26.95,58.9 v26.97,58.04 | IC16.12 76.71,31.36 76.69,31.37
  Top 1.016: v86.85,48.51 v86.85,42.8 v86.85,35.69 v86.85,28.45 v81.9,28.45 v81.9,25.27
  other vias: 63.17,50.42 63.1,46.93 76.62,33.21 75.42,33.21 74.23,33.21 68.31,38.54 75.41,30.54 74.22,30.54 76.62,30.54 76.62,31.88 75.41,31.88 74.2,31.88 86.09,14.86
  pour Top (isolate 0.305, no thermals): 77.65,34.61 77.65,29.27 80.63,29.27 80.69,24.07 78.53,21.91 71.74,21.97 71.74,28.38 73.2,28.38 73.2,34.61
  pour Bottom (isolate 0.305, rank 2): 100.12,0.32 77.9,0.32 77.9,20.19 75.68,22.42 65.01,22.42 59.8,27.62 59.8,33.97 47.48,46.29 37.26,46.29 25.32,58.29 25.32,71.88 34.02,71.88 34.02,58.36 39.55,52.83 69.64,52.83 69.71,53.15 69.71,73.98 99.17,73.98 100.12,73.03
IS1
  Top 0.356: IC16.13 79.35,32.02 79.55,31.81
  pour Top (isolate 0.305, no thermals): 78.53,32.07 81.27,32.07 81.9,32.7 85.9,32.7 85.9,29.4 81.52,29.4 81.52,31.05 79.49,31.05 79.49,31.81 79.36,31.94 78.53,31.94
MCU_D+
  Top 0.305: IC19.10 30.15,65.28 29.45,65.98 29.45,70.42 X10.3
MCU_D-
  Top 0.305: IC19.11 32.56,64.01 33.39,64.83 33.39,70.42 X10.2
N$52
  Top 0.254: R125.2 66.59,27.24 66.6,27.24 68.35,27.24 C95.2
N$57
  Top 0.254: IC16.6 71.6,30.72 70.66,29.78 R126.1 R121.2 68.82,25.59 C95.1 | 68.69,25.59 C95.1 | C96.1 66.59,25.21 66.66,25.27 68.28,25.27 C95.1
N$58
  Top 0.356: C87.2 78.79,34.04 78.72,33.97 IC16.16
N$59
  Top 0.254: IC16.5 71.47,31.36 68.88,28.77 66.72,28.77 R124.1 66.59,28.89 65.52,29.97 63.87,29.97 63.55,29.65 63.55,25.65 64.25,24.96 C96.2
N$60
  Top 0.254: IC16.7 71.7,30.06 71.49,29.84 71.49,29.02 71.74,28.77 73.96,28.77 74.41,28.32 74.41,26.42 75.23,25.59 R123.1
N$61  (1 unrouted)
  Top 0.356: IC16.1 72.58,34.15 72.57,34.16
  Top 0.406: 72.57,34.16 72.57,35.75 72.63,35.81
N$63
  Top 0.254: 75.3,27.56 C94.2
  Top 0.305: IC16.8 74.28,29.4 75.23,28.45 75.23,27.62 75.3,27.56
N$66
  Top 0.305: IC16.10 79.33,30.06 79.61,29.78 79.61,27.94 C90.1
N$68  (via drill 0.6)
  Top 0.254: 72.58,32 IC16.4 71.25,32.02 68.88,29.65 v68.18,29.65 | X5.7 96.28,52.67 94.98,51.37 92.25,51.37 88.44,47.56 88.44,28.83 v88.19,28.57
  Bottom 0.254: v68.18,29.65 70.34,27.5 87.61,27.5 88.12,28 88.12,28.51 v88.19,28.57
N$69
  Top 0.254: IC16.2 72.58,33.34 | 72.58,33.34 72.63,33.34 | 72.58,33.34 71.36,33.34 70.92,33.78 70.92,35.62 70.6,35.94 67.23,35.94 66.53,36.64 R118.1 R119.2
N$70
  Top 0.61: C89.2 R120.2
N$71  (via drill 0.6)
  Top 0.61: OK1.6 v69.45,13.65 | R111.1 42.59,19.69 Q21.G
  Bottom 0.61: v69.45,13.65 65.9,13.65 55.99,23.56 44.94,23.56 42.66,21.27 Q21.G
N$72  (via drill 0.6)  (1 unrouted)
  Top 0.406: R110.2 Q20.G
  Top 0.61: OK2.4 v69.45,9.84
  Bottom 0.61: v69.45,9.84 68.95,9.34 54.4,9.34 53.58,10.16
N$73
  Top 0.61: R115.1 69.57,2.92 OK2.6
N$74
  Top 0.254: R114.1 R113.2
N$75
  Top 0.254: R116.2 R117.1
N$76
  Top 0.61: OK1.4 65.52,18.73 R112.1
N$81  (via drill 0.6)
  Top 0.305: 16.82,9.53 17.52,9.53 v17.89,9.91 v17.89,8.95 19.28,8.95 R109.1
  Top 0.61: v65.96,7.24 R115.2 R112.2
  Top 1.27: R108.1 16.82,9.53
  Bottom 0.305: 14.46,12.19 15.61,12.19 v17.89,9.91
  Bottom 1.27: v65.96,7.24 65.96,7.18 62.47,3.68 50.78,3.68 47.83,6.64
  Bottom 3.048: X4.3 21.66,53.32 23.8,51.18 23.8,46.23 18.46,40.89 18.46,33.59 14.46,29.59 14.46,12.19 23.48,3.17 44.37,3.17 47.83,6.64 48.12,6.92 Q20.A2 Q21.A2
N$83
  Top 1.27: R109.2 R108.2 12.36,3.93 C86.2
N$84
  Top 0.254: R129.2 C98.1
N$85
  Top 0.254: Q22.1 93.15,13.26 | 93.15,13.26 R128.2 | 93.15,13.26 93.2,13.31 93.2,21.02 91.87,22.35 89.01,22.35 88,23.37 88,25.4 90.28,27.69 90.28,33.47 90.41,33.59 R127.1
N$86
  Top 0.813: L10.1 98.11,19.26 98.22,19.37 98.28,19.37 98.54,19.62 98.54,27.3 | 98.54,27.3 98.54,33.97 97.14,35.37 X6.2 | C97.2 98.35,27.11 98.54,27.3
N$87  (1 unrouted)
  Top 0.406: 45.2,60.71 44.69,60.2 IC19.3 IC19.4 IC19.5
N$88  (1 unrouted)
  Top 0.406: IC19.6 43.16,64.01 R132.2
N$89
  Top 0.406: IC19.7 43.23,65.28 R133.2
N$90
  Top 0.406: 43.32,57.34 C100.1 | IC19.1 42.95,57.66 C100.1 | FB5.P$2 44.92,55.69 C100.1
N$91
  Top 0.406: C102.1 27.44,60.2 IC19.14 IC19.13 IC19.12
N$114
  Top 3.048: VAR1.P$1 VAR2.P$2 13.4,32.98 SAR1.P$1
N$125
  Top 0.406: FB4.P$1 84.55,68.58 X7.2
N$152
  Top 0.406: R110.1 46.91,5.97 Q20.A1
  Bottom 3.048: Q20.A1 42.66,8.95 41.58,7.87 28.81,7.87 R107.2
N$163
  Top 0.254: D21.C 98.66,61.27 98.66,40.77 X6.3
N$169
  Top 0.254: R122.1 R123.2
N$171
  Top 0.254: R125.1 R124.2
N$174
  Top 0.305: OK2.2 82.54,6.54 R116.1
N$175
  Top 0.254: OK1.2 R113.1
SW2  (via drill 0.6)
  Top 0.305: IC16.14 79.69,32.65
  Top 0.356: IC16.15 80.08,33.31 80.12,33.27
  Top 0.813: L9.1 80.75,44.01
  other vias: 84.38,41.27 84.38,42.8 84.38,44.32 84.38,45.85 84.38,47.24 84.38,48.64 84.38,39.75
  pour Top (isolate 0.305, rank 3, no thermals): 75.87,49.66 85.84,49.66 85.84,37.59 83.61,37.53 83.61,34.16 82.53,34.16 81.01,32.64 79.68,32.64 79.61,32.7 77.71,32.7 77.71,33.34 79.61,33.34 80.12,33.85 80.12,37.97 79.8,38.29 75.87,38.29
  pour Bottom (no thermals): 85.52,49.02 78.98,49.02 78.98,40.83 81.77,37.97 85.52,37.97
TA1  (via drill 3.2 pad 6)
  other vias: 96,70
TA2  (via drill 3.2 pad 6)
  other vias: 96,7
TA3  (via drill 3.2 pad 6)
  other vias: 4,70
VIN  (via drill 0.6)
  Top 0.254: C97.1 92.19,27.43
  Top 0.813: L8.1 65.01,31.62 64.75,31.81 v63.8,31.81 | D20.C 89.2,24.45 92.19,27.43 95.81,31.05 X6.1
  Bottom 0.813: v63.8,31.81 63.74,31.81 63.74,35 63.72,35 49.42,49.31 TR2.7 49.07,49.26 49.07,48.07 62.53,34.61 62.53,31.37 67.23,26.67 90.03,26.67 95.81,32.45 X6.1
XUSB_GND
  Top 0.406: IC19.2 43.2,58.93 C100.2 45.25,59.02 C103.2
  pour Top (isolate 0.305): 38.34,72.96 61.58,72.96 61.58,54.1 41.32,54.1 38.34,56.45
  pour Bottom (isolate 0.305): 38.34,72.96 61.58,72.96 61.58,54.1 40.69,54.1 38.34,56.45
XUSB_VBUS
  Top 0.406: X9.1 53.96,67.25 53.71,66.99 | 53.71,66.99 51.99,65.28 51.99,61.91 | 51.99,61.91 51.99,58.42 49.26,55.69 FB5.P$1 | X11.1 52.08,61.82 51.99,61.91 | 53.71,66.99 C101.2 57.75,66.41 IC18.4

### Text on the board
Bottom: EEZ AUX PS r5B9 | (07/2016)
tPlace: (Isolated) | EEZ AUX PS r5B9 (07/2016)
bPlace: Shield 5 | Gnd 4 | Data+ 3 | Data- 2 | +Vcc 1 | +3.3V 8 | TX- 7 | TX+ 6 | RX- 5 | RX+ 4 | Shield 3 | LED Active 2 | LED Link 1 | RJ-45 Ethernet X8 | USB (non-isolated) X9 | 10 +5V | 8 +5V | 6 FAN_PWM | 4 PWR_SSTART | 2 Gnd | Fan sense (Yellow) 3 | Fan- (Black) 2 | Fan+ (Red) 1 | Gnd 9 | Sync 7 | FAN_SENSE 5 | PWR_DIRECT 3 | Gnd 1 | Fan X6 | Power X5 | Project source code: github.com/eez-open
dimension2: Licensed under the TAPR Open Hardware License (www.tapr.org/OHL)
custom: M3 | M3
_tNames: X8 | X9 | X10 | FB6 | C101 | FB4 | X4 | R133 | R130 | IC18 | R131 | D21 | IC19 | R132 | C102 | C103 | C85 | X5 | IC17 | C99 | C100 | TR2 | FB5 | C93 | L9 | C92 | R119 | VAR1 | X6 | C89 | R118 | C88 | C91 | R127 | VAR2 | C87 | R120 | R124 | IC16 | L8 | R126 | D19 | SAR1 | R125 | C94 | C97 | C90 | R123 | C95 | R121 | D20 | R111 | C96 | R114 | ZD7 | OK1 | R122 | Q21 | R129 | R113 | R112 | C98 | ZD6 | L10 | R128 | R117 | C86 | R109 | R116 | R115 | Q20 | Q22 | R110 | R108 | R107 | KK1 | OK2
_bNames: X11 | X7